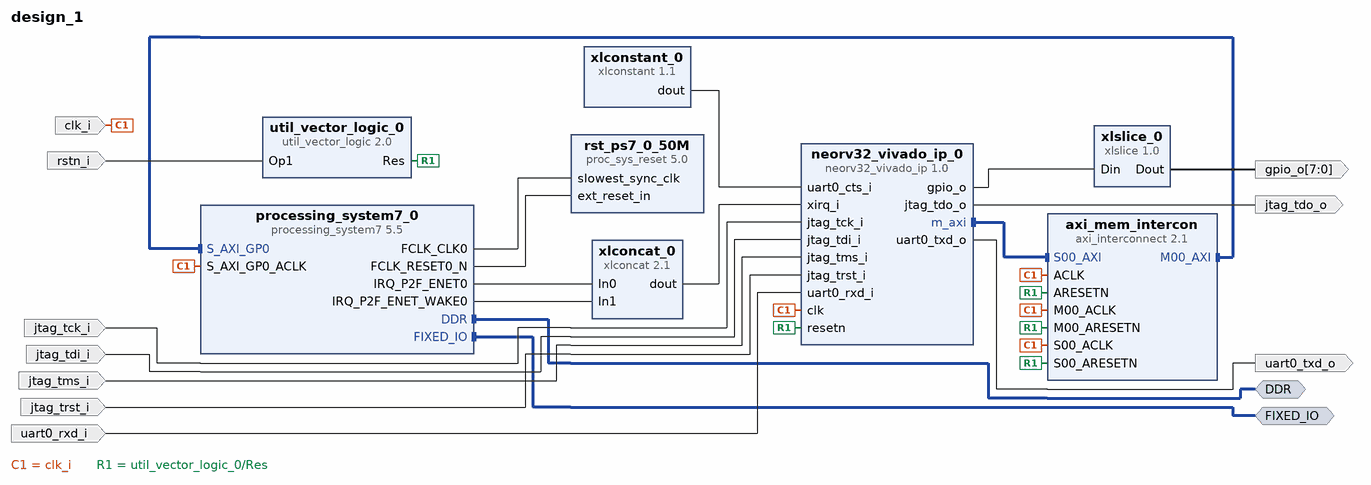
[diagram p0: block diagram of the top level]
# Vivado block design design_1, xc7z020clg484-1, Vivado 2023.2
create_bd_design design_1

create_bd_intf_port -mode Master -vlnv xilinx.com:interface:ddrx_rtl:1.0 DDR
create_bd_intf_port -mode Master -vlnv xilinx.com:display_processing_system7:fixedio_rtl:1.0 FIXED_IO
create_bd_port -dir O -from 7 -to 0 gpio_o
create_bd_port -dir I -type data uart0_rxd_i
create_bd_port -dir O -type data uart0_txd_o
create_bd_port -dir I -type rst rstn_i
set_property -dict {CONFIG.POLARITY ACTIVE_HIGH} [get_bd_ports rstn_i]
create_bd_port -dir I -type clk clk_i
set_property -dict {CONFIG.FREQ_HZ 100000000} [get_bd_ports clk_i]
create_bd_port -dir I jtag_tms_i
create_bd_port -dir I jtag_tck_i
create_bd_port -dir I -type data jtag_tdi_i
create_bd_port -dir O jtag_tdo_o
create_bd_port -dir I -type rst jtag_trst_i

create_bd_cell -type ip -vlnv NEORV32:user:neorv32_vivado_ip:1.0 neorv32_vivado_ip_0
set_property -dict [list \
  CONFIG.CLOCK_FREQUENCY 100000000 \
  CONFIG.CPU_EXTENSION_RISCV_C true \
  CONFIG.CPU_EXTENSION_RISCV_M true \
  CONFIG.CPU_EXTENSION_RISCV_U false \
  CONFIG.INT_BOOTLOADER_EN true \
  CONFIG.IO_GPIO_NUM 8 \
  CONFIG.IO_MTIME_EN true \
  CONFIG.IO_UART0_EN true \
  CONFIG.MEM_INT_DMEM_EN true \
  CONFIG.MEM_INT_DMEM_SIZE 65536 \
  CONFIG.MEM_INT_IMEM_EN true \
  CONFIG.MEM_INT_IMEM_SIZE 262144 \
  CONFIG.ON_CHIP_DEBUGGER_EN true \
  CONFIG.XBUS_CACHE_EN false \
  CONFIG.XIRQ_NUM_CH 1 \
  CONFIG.XIRQ_TRIGGER_TYPE 0x00000000 \
] [get_bd_cells neorv32_vivado_ip_0]
create_bd_cell -type ip -vlnv xilinx.com:ip:processing_system7:5.5 processing_system7_0
set_property -dict [list \
  CONFIG.PCW_ENET0_ENET0_IO {MIO 16 .. 27} \
  CONFIG.PCW_ENET0_GRP_MDIO_ENABLE 1 \
  CONFIG.PCW_ENET0_GRP_MDIO_IO {MIO 52 .. 53} \
  CONFIG.PCW_ENET0_PERIPHERAL_ENABLE 1 \
  CONFIG.PCW_FPGA0_PERIPHERAL_FREQMHZ 100 \
  CONFIG.PCW_P2F_ENET0_INTR 1 \
  CONFIG.PCW_PRESET_BANK1_VOLTAGE {LVCMOS 1.8V} \
  CONFIG.PCW_UART0_PERIPHERAL_ENABLE 1 \
  CONFIG.PCW_UART0_UART0_IO {MIO 30 .. 31} \
  CONFIG.PCW_UART_PERIPHERAL_FREQMHZ 100 \
  CONFIG.PCW_UIPARAM_DDR_PARTNO {MT41K128M16 JT-125} \
  CONFIG.PCW_USE_FABRIC_INTERRUPT 1 \
  CONFIG.PCW_USE_M_AXI_GP0 0 \
  CONFIG.PCW_USE_S_AXI_GP0 1 \
] [get_bd_cells processing_system7_0]
# 91 more settings of processing_system7_0 are not shown: defaults, MIO pin electricals, DDR timing, and values the tool derives
create_bd_cell -type ip -vlnv xilinx.com:ip:axi_interconnect:2.1 axi_mem_intercon
set_property -dict {CONFIG.NUM_MI 1} [get_bd_cells axi_mem_intercon]
create_bd_cell -type ip -vlnv xilinx.com:ip:proc_sys_reset:5.0 rst_ps7_0_50M
create_bd_cell -type ip -vlnv xilinx.com:ip:xlconstant:1.1 xlconstant_0
set_property -dict {CONFIG.CONST_VAL 0} [get_bd_cells xlconstant_0]
create_bd_cell -type ip -vlnv xilinx.com:ip:util_vector_logic:2.0 util_vector_logic_0
set_property -dict {CONFIG.C_OPERATION not CONFIG.C_SIZE 1} [get_bd_cells util_vector_logic_0]
create_bd_cell -type ip -vlnv xilinx.com:ip:xlslice:1.0 xlslice_0
set_property -dict {CONFIG.DIN_FROM 7 CONFIG.DIN_TO 0 CONFIG.DIN_WIDTH 64} [get_bd_cells xlslice_0]
create_bd_cell -type ip -vlnv xilinx.com:ip:xlconcat:2.1 xlconcat_0
set_property -dict {CONFIG.NUM_PORTS 32} [get_bd_cells xlconcat_0]

# ---- connections ----

connect_bd_intf_net [get_bd_intf_pins axi_mem_intercon/M00_AXI] [get_bd_intf_pins processing_system7_0/S_AXI_GP0]
connect_bd_intf_net [get_bd_intf_pins neorv32_vivado_ip_0/m_axi] [get_bd_intf_pins axi_mem_intercon/S00_AXI]
connect_bd_intf_net [get_bd_intf_ports DDR] [get_bd_intf_pins processing_system7_0/DDR]
connect_bd_intf_net [get_bd_intf_ports FIXED_IO] [get_bd_intf_pins processing_system7_0/FIXED_IO]
connect_bd_net [get_bd_ports clk_i] \
  [get_bd_pins processing_system7_0/S_AXI_GP0_ACLK] [get_bd_pins axi_mem_intercon/ACLK] \
  [get_bd_pins axi_mem_intercon/S00_ACLK] [get_bd_pins axi_mem_intercon/M00_ACLK] [get_bd_pins neorv32_vivado_ip_0/clk]
connect_bd_net [get_bd_ports jtag_tck_i] [get_bd_pins neorv32_vivado_ip_0/jtag_tck_i]
connect_bd_net [get_bd_ports jtag_tdi_i] [get_bd_pins neorv32_vivado_ip_0/jtag_tdi_i]
connect_bd_net [get_bd_ports jtag_tms_i] [get_bd_pins neorv32_vivado_ip_0/jtag_tms_i]
connect_bd_net [get_bd_ports jtag_trst_i] [get_bd_pins neorv32_vivado_ip_0/jtag_trst_i]
connect_bd_net [get_bd_pins neorv32_vivado_ip_0/gpio_o] [get_bd_pins xlslice_0/Din]
connect_bd_net [get_bd_pins neorv32_vivado_ip_0/jtag_tdo_o] [get_bd_ports jtag_tdo_o]
connect_bd_net [get_bd_pins neorv32_vivado_ip_0/uart0_txd_o] [get_bd_ports uart0_txd_o]
connect_bd_net [get_bd_pins processing_system7_0/FCLK_CLK0] [get_bd_pins rst_ps7_0_50M/slowest_sync_clk]
connect_bd_net [get_bd_pins processing_system7_0/FCLK_RESET0_N] [get_bd_pins rst_ps7_0_50M/ext_reset_in]
connect_bd_net [get_bd_pins processing_system7_0/IRQ_P2F_ENET0] [get_bd_pins xlconcat_0/In0]
connect_bd_net [get_bd_pins processing_system7_0/IRQ_P2F_ENET_WAKE0] [get_bd_pins xlconcat_0/In1]
connect_bd_net [get_bd_ports rstn_i] [get_bd_pins util_vector_logic_0/Op1]
connect_bd_net [get_bd_ports uart0_rxd_i] [get_bd_pins neorv32_vivado_ip_0/uart0_rxd_i]
connect_bd_net [get_bd_pins util_vector_logic_0/Res] \
  [get_bd_pins axi_mem_intercon/ARESETN] [get_bd_pins axi_mem_intercon/S00_ARESETN] \
  [get_bd_pins axi_mem_intercon/M00_ARESETN] [get_bd_pins neorv32_vivado_ip_0/resetn]
connect_bd_net [get_bd_pins xlconcat_0/dout] [get_bd_pins neorv32_vivado_ip_0/xirq_i]
connect_bd_net [get_bd_pins xlconstant_0/dout] [get_bd_pins neorv32_vivado_ip_0/uart0_cts_i]
connect_bd_net [get_bd_pins xlslice_0/Dout] [get_bd_ports gpio_o]

# ---- address map ----
assign_bd_address -offset 0x00000000 -range 512M -target_address_space [get_bd_addr_spaces neorv32_vivado_ip_0/m_axi] [get_bd_addr_segs processing_system7_0/S_AXI_GP0/GP0_DDR_LOWOCM]
assign_bd_address -offset 0xE0000000 -range 4M -target_address_space [get_bd_addr_spaces neorv32_vivado_ip_0/m_axi] [get_bd_addr_segs processing_system7_0/S_AXI_GP0/GP0_IOP]

validate_bd_design
save_bd_design
